# Altium schematic sheet Temp_CSC_Conns.SchDoc
size A4
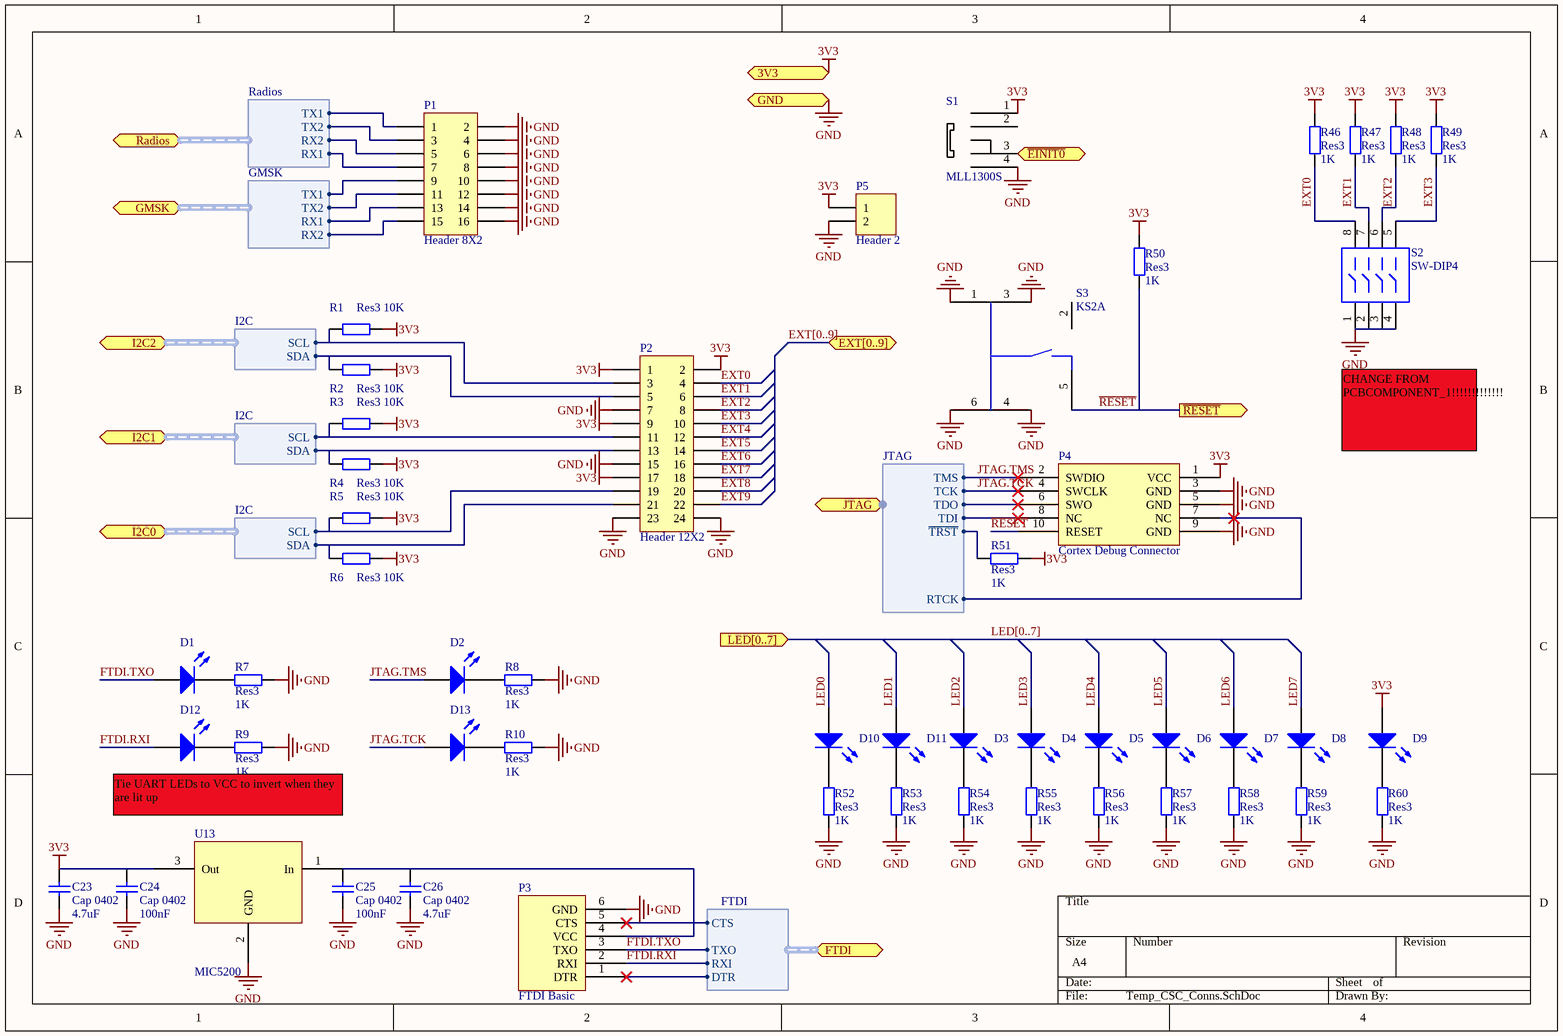
[diagram p0: Temp_CSC_Conns.SchDoc]

## Parts
C23  Cap 0402  value 4.7uF  [CAPC1005X06L]
C24  Cap 0402  value 100nF  [CAPC1005X06L]
C25  Cap 0402  value 100nF  [CAPC1005X06L]
C26  Cap 0402  value 4.7uF  [CAPC1005X06L]
D1  LED - ASMT-Rx45  [ASMT-Rx45]  (value not drawn)
D2  LED - ASMT-Rx45  [ASMT-Rx45]  (value not drawn)
D3  LED - ASMT-Rx45  [ASMT-Rx45]  (value not drawn)
D4  LED - ASMT-Rx45  [ASMT-Rx45]  (value not drawn)
D5  LED - ASMT-Rx45  [ASMT-Rx45]  (value not drawn)
D6  LED - ASMT-Rx45  [ASMT-Rx45]  (value not drawn)
D7  LED - ASMT-Rx45  [ASMT-Rx45]  (value not drawn)
D8  LED - ASMT-Rx45  [ASMT-Rx45]  (value not drawn)
D9  LED - ASMT-Rx45  [ASMT-Rx45]  (value not drawn)
D10  LED - ASMT-Rx45  [ASMT-Rx45]  (value not drawn)
D11  LED - ASMT-Rx45  [ASMT-Rx45]  (value not drawn)
D12  LED - ASMT-Rx45  [ASMT-Rx45]  (value not drawn)
D13  LED - ASMT-Rx45  [ASMT-Rx45]  (value not drawn)
P1  Header 8X2  [HDR2X8]
P2  Header 12X2  [HDR2X12]
P3  FTDI Basic  [FTDI BASIC]
P4  Cortex Debug Connector  [FTSH-105-01-L-DV-TR]
P5  Header 2  [HDR1X2]
R1  Res3  value 10K  [RESC1005X06L]
R2  Res3  value 10K  [RESC1005X06L]
R3  Res3  value 10K  [RESC1005X06L]
R4  Res3  value 10K  [RESC1005X06L]
R5  Res3  value 10K  [RESC1005X06L]
R6  Res3  value 10K  [RESC1005X06L]
R7  Res3  value 1K  [RESC1005X06L]
R8  Res3  value 1K  [RESC1005X06L]
R9  Res3  value 1K  [RESC1005X06L]
R10  Res3  value 1K  [RESC1005X06L]
R46  Res3  value 1K  [RESC1005X06L]
R47  Res3  value 1K  [RESC1005X06L]
R48  Res3  value 1K  [RESC1005X06L]
R49  Res3  value 1K  [RESC1005X06L]
R50  Res3  value 1K  [RESC1005X06L]
R51  Res3  value 1K  [RESC1005X06L]
R52  Res3  value 1K  [RESC1005X06L]
R53  Res3  value 1K  [RESC1005X06L]
R54  Res3  value 1K  [RESC1005X06L]
R55  Res3  value 1K  [RESC1005X06L]
R56  Res3  value 1K  [RESC1005X06L]
R57  Res3  value 1K  [RESC1005X06L]
R58  Res3  value 1K  [RESC1005X06L]
R59  Res3  value 1K  [RESC1005X06L]
R60  Res3  value 1K  [RESC1005X06L]
S1  MLL1300S  [MILL1300S]
S2  SW-DIP4  [PCBComponent_1]
S3  KS2A  [K5A2]
U13  MIC5200  [SOT230P710X170-4L]

## Ports
3V3 (in), EXT[0..9] (bidir), FTDI (harness FTDI), GMSK (harness GMSK), GND (in), I2C0 (harness I2C), I2C1 (harness I2C), I2C2 (harness I2C), JTAG (harness JTAG), LED[0..7] (in), Radios (harness Radios), ~{EINIT0} (out), ~{RESET} (out)

## Harnesses
JTAG: RTCK, ~{TRST}, TCK, TDI, TDO, TMS
FTDI: DTR, RXI, TXO, CTS
I2C: SCL, SDA
GMSK: RX1, RX2, TX1, TX2
Radios: RX1, RX2, TX1, TX2

## Nets
3V3: C23.2 C24.2 D9.1(A) P2.1 P2.2 P2.9 P2.17 P4.1(VCC) P5.1 R1.2 R2.2 R3.2 R4.2 R5.2 R6.2 R46.1 R47.1 R48.1 R49.1 R50.1 R51.2 S1.1 U13.3(Out) ; port 3V3
GND: C23.1 C24.1 C25.1 C26.1 P1.2 P1.4 P1.6 P1.8 P1.10 P1.12 P1.14 P1.16 P2.7 P2.15 P2.23 P2.24 P3.6(GND) P4.3(GND) P4.5(GND) P4.9(GND) P5.2 R7.2 R8.2 R9.2 R10.2 R52.2 R53.2 R54.2 R55.2 R56.2 R57.2 R58.2 R59.2 R60.2 S1.4 S2.1 S2.2 S2.3 S2.4 S3.1 S3.3 S3.4 S3.6 U13.2(GND) ; port GND
~{EINIT0}: S1.3 ; port ~{EINIT0}
EXT0: P2.4 R46.2 S2.8
EXT1: P2.6 R47.2 S2.7
EXT2: P2.8 R48.2 S2.6
EXT3: P2.10 R49.2 S2.5
EXT4: P2.12
EXT5: P2.14
EXT6: P2.16
EXT7: P2.18
EXT8: P2.20
EXT9: P2.22
FTDI.RXI: D12.1(A) P3.2(RXI) ; port FTDI.RXI
FTDI.TXO: D1.1(A) P3.3(TXO) ; port FTDI.TXO
JTAG.TCK: D13.1(A) P4.4(SWCLK) ; port JTAG.TCK
JTAG.TMS: D2.1(A) P4.2(SWDIO) ; port JTAG.TMS
LED0: D10.1(A)
LED1: D11.1(A)
LED2: D3.1(A)
LED3: D4.1(A)
LED4: D5.1(A)
LED5: D6.1(A)
LED6: D7.1(A)
LED7: D8.1(A)
~{RESET}: P4.10(RESET) R50.2 S3.5 ; port ~{RESET}
NetC25_2: C25.2 C26.2 P3.4(VCC) U13.1(In)
NetD1_2: D1.2(K) R7.1
NetD2_2: D2.2(K) R8.1
NetD3_2: D3.2(K) R54.1
NetD4_2: D4.2(K) R55.1
NetD5_2: D5.2(K) R56.1
NetD6_2: D6.2(K) R57.1
NetD7_2: D7.2(K) R58.1
NetD8_2: D8.2(K) R59.1
NetD9_2: D9.2(K) R60.1
NetD10_2: D10.2(K) R52.1
NetD11_2: D11.2(K) R53.1
NetD12_2: D12.2(K) R9.1
NetD13_2: D13.2(K) R10.1
NetP1_1: P1.1 ; port Radios.TX1
NetP1_3: P1.3 ; port Radios.TX2
NetP1_5: P1.5 ; port Radios.RX2
NetP1_7: P1.7 ; port Radios.RX1
NetP1_9: P1.9 ; port GMSK.TX1
NetP1_11: P1.11 ; port GMSK.TX2
NetP1_13: P1.13 ; port GMSK.RX1
NetP1_15: P1.15 ; port GMSK.RX2
NetP2_3: P2.3 R1.1 ; port I2C2.SCL
NetP2_5: P2.5 R2.1 ; port I2C2.SDA
NetP2_11: P2.11 R3.1 ; port I2C1.SCL
NetP2_13: P2.13 R4.1 ; port I2C1.SDA
NetP2_19: P2.19 R5.1 ; port I2C0.SCL
NetP2_21: P2.21 R6.1 ; port I2C0.SDA
NetP3_1: P3.1(DTR) ; port FTDI.DTR
NetP3_5: P3.5(CTS) ; port FTDI.CTS
NetP4_6: P4.6(SWO) ; port JTAG.TDO
NetP4_7: P4.7(NC) ; port JTAG.RTCK
NetP4_8: P4.8(NC) ; port JTAG.TDI
NetR51_1: R51.1 ; port JTAG.~{TRST}

Not connected (* = marked no-connect by the designer): S1 2; S3 2

## Buses and harness runs
bus EXT[0..9] = port EXT[0..9]
bus LED[0..7] = port LED[0..7]

## Notes on the sheet
- CHANGE FROM PCBCOMPONENT_1!!!!!!!!!!!!!
- Tie UART LEDs to VCC to invert when they are lit up

## Library data of the parts
C23-C26 = Cap 0402: Capacitor; Published: 8-Jun-2000; LatestRevisionDate: 17-Jul-2002; LatestRevisionNote: Re-released for DXP Platform.; PackageReference: RAD-0.3; Publisher: Altium Limited; PackageDescription: Radial Cap, Thru-Hole; 2 Leads; 0.3 in Pin Spacing
D1-D13 = LED: Typical INFRARED GaAs LED 0603; Published: 8-Jun-2000; LatestRevisionDate: 08-Jul-2005; LatestRevisionNote: Mech Layer 1 removed.; PackageReference: LED-0; Publisher: Altium Limited; PackageDescription: LED; 2 Leads
P1 = Header 8X2: Header, 8-Pin, Dual row; LatestRevisionDate: 17-Jul-2002; LatestRevisionNote: Re-released for DXP Platform.; Publisher: Altium Limited
P2 = Header 12X2: Header, 12-Pin, Dual row; LatestRevisionDate: 17-Jul-2002; LatestRevisionNote: Re-released for DXP Platform.; Publisher: Altium Limited
P4 = Cortex Debug Connector: Mates with FFSD-05-D-12.00-01-N
P5 = Header 2: Header, 2-Pin; LatestRevisionDate: 17-Jul-2002; LatestRevisionNote: Re-released for DXP Platform.; Publisher: Altium Limited
R1-R10 R46-R60 = Res3: Resistor; Published: 8-Jun-2000; LatestRevisionDate: 29-May-2009; LatestRevisionNote: IPC-7351 Footprint Added.; PackageReference: J1-0603; Publisher: Altium Limited; PackageDescription: Chip Resistor
S1 = MLL1300S: Slide switch SP3T switch
S2 = SW-DIP4: DIP Switch - 1571983-5; Published: 24-Mar-1999; LatestRevisionDate: 17-Jul-2002; LatestRevisionNote: Re-released for DXP Platform.; PackageReference: DIP-8; Publisher: Altium Limited
S3 = KS2A: Tact Switch